# EasyEDA Pro project PCB.epro, board ESCSTRACk
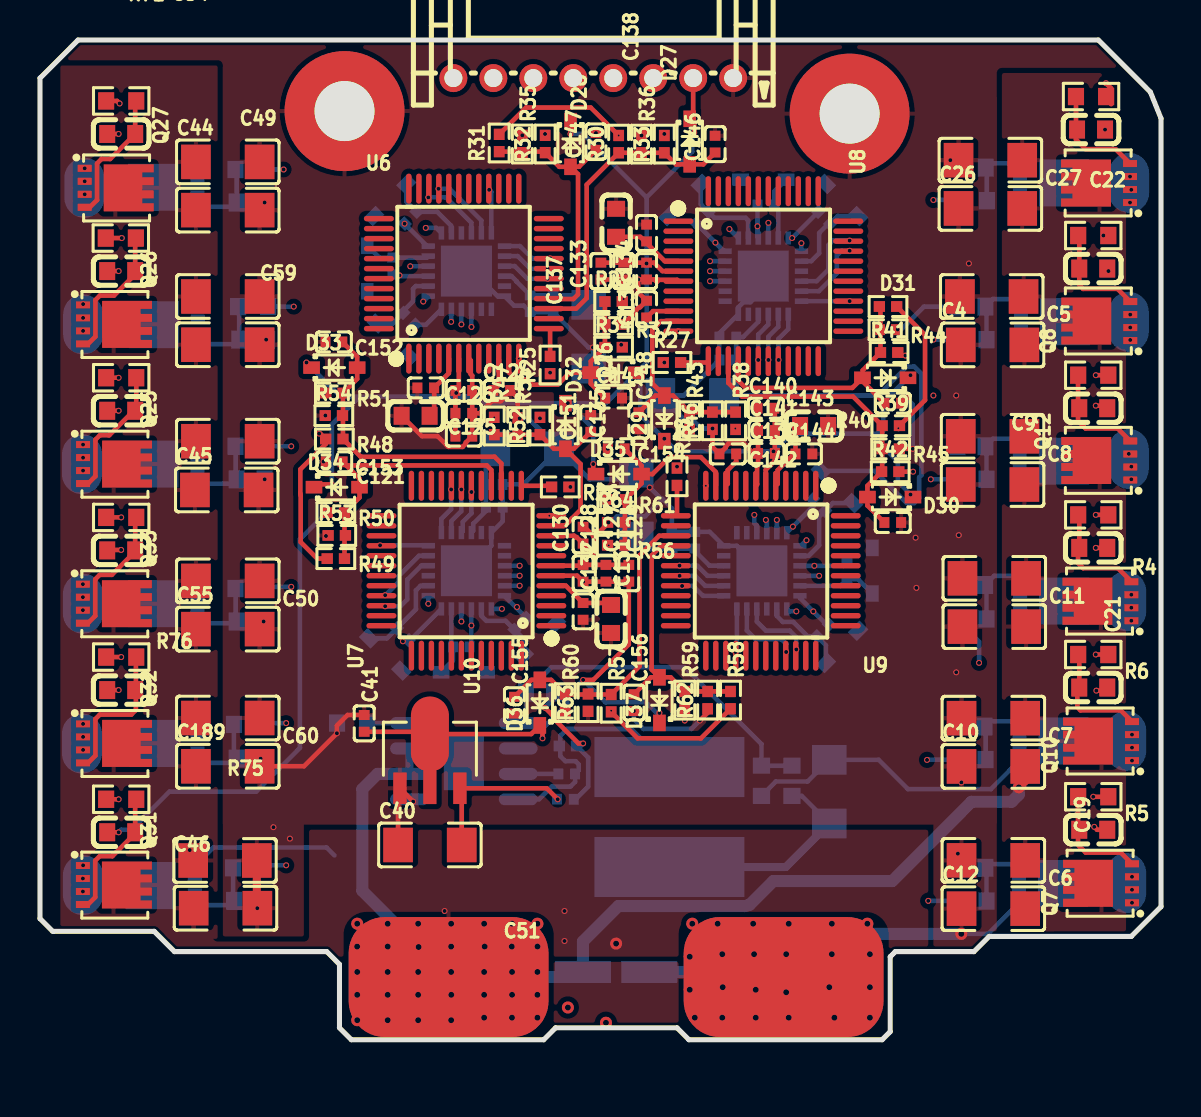
[diagram p0: board, top side]
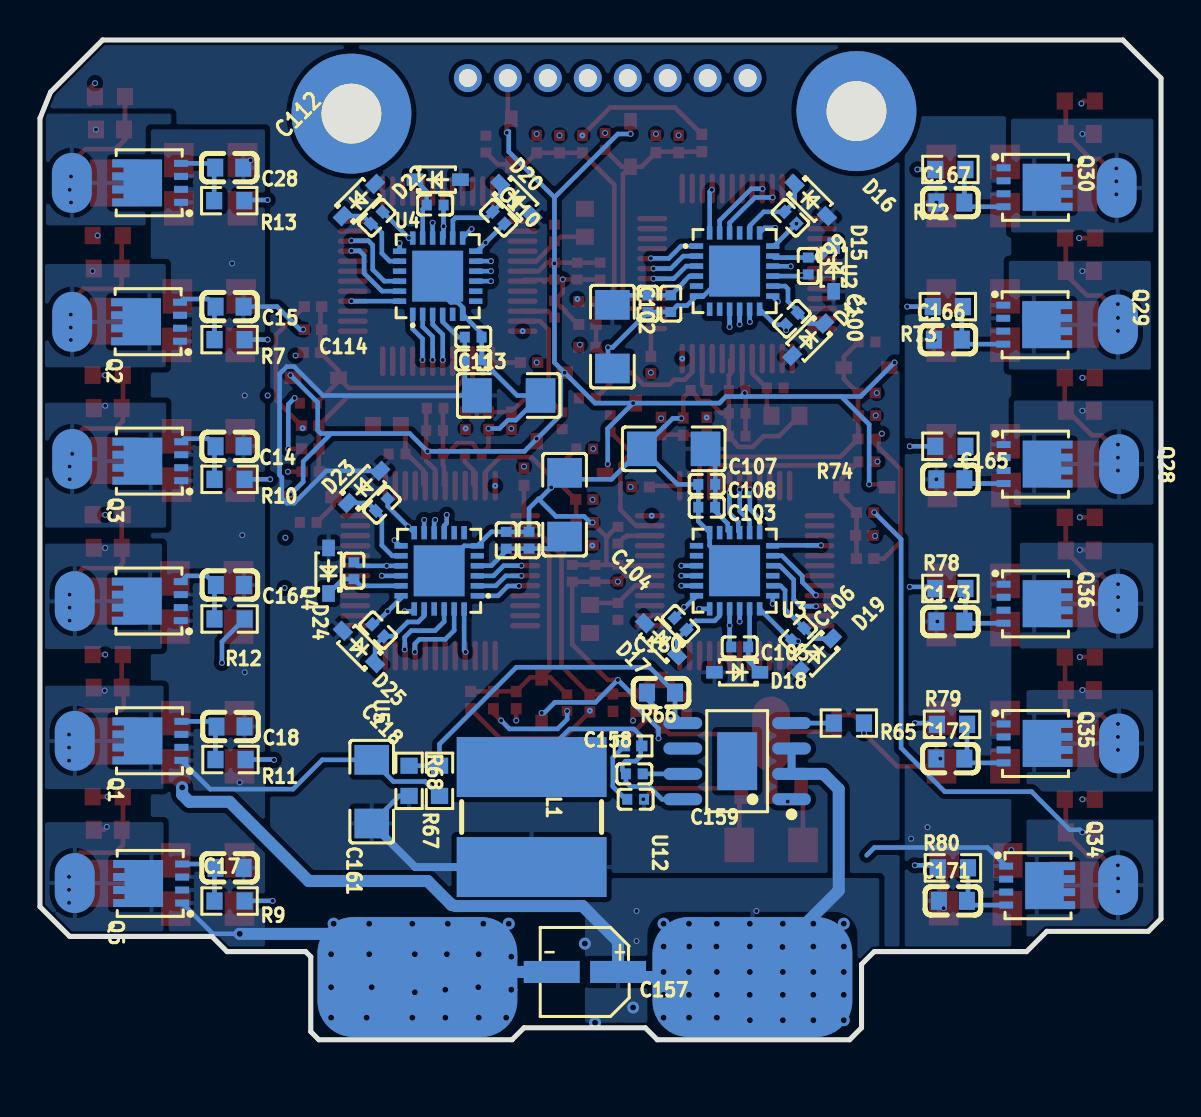
[diagram p1: board, bottom side, seen from below]

Outline 56.1 x 50 mm; copper layers: Top Layer, Inner1, Inner2, Inner3, Inner4, Bottom Layer. Coordinates in mm from the lower left corner of the outline.
Outline path: 0,48.09 1.91,50 52.96,50 55.56,47.39 56.1,46.08 56.1,6.66 54.61,5.17 47.5,5.17 46.74,4.41 42.8,4.41 42.54,4.15 42.54,0.41 42.14,0 32.47,0 31.88,0.6 25.8,0.6 25.2,0 15.58,0 14.99,0.6 14.99,3.77 14.35,4.41 6.73,4.41 5.72,5.42 0.64,5.42 0,6.06 0,48.09
Stack: Top Layer 0.035mm Outer layer thickness 1oz / Dielectric1 0.0994mm 3313 RC57% 4.2mil / Inner1 0.0152mm Inner layer thickness / Dielectric2 0.55mm 0.55mm H/H No copper / Inner2 0.0152mm Inner layer thickness / Dielectric3 0.1088mm 2116 RC54% 4.9mil / Inner3 0.0152mm Inner layer thickness / Dielectric4 0.55mm 0.55mm H/H No copper / Inner4 0.0152mm Inner layer thickness / Dielectric5 0.0994mm 3313 RC57% 4.2mil / Bottom Layer 0.035mm Outer layer thickness 1oz

## Design rules (mm)
spacing copperThickness1oz: track to track 0.102, other pairs 0.152 to 0.3
spacing copperThickness2oz (default): track to track 0.203, other pairs 0.152 to 0.3
spacing Plane_innerPlane: track to track 0.203, other pairs 0.152 to 0.3
spacing Copper_copperRegion: track to track 0.203, other pairs 0.152 to 0.3
track width copperThickness1oz: min 0.127, default 0.254, max 2.54
track width copperThickness2oz (default): min 0.203, default 0.254, max 2.54
differential pair differentialPair (default): width min 0.127, default 0.254, max 2.54; gap min 0.152, default 0.152
net VCC uses copperRegion_copperThickness2oz
net +10V uses copperRegion_copperThickness2oz
net GND uses copperRegion_copperThickness2oz
net +3.3V uses copperRegion_copperThickness2oz
net MOTORC_1 uses copperRegion_copperThickness2oz
net MOTORB_1 uses copperRegion_copperThickness2oz
net MOTORA_1 uses copperRegion_copperThickness2oz
net MOTORC_3 uses copperRegion_copperThickness2oz
net MOTORB_3 uses copperRegion_copperThickness2oz
net MOTORA_3 uses copperRegion_copperThickness2oz
net MOTORC_2 uses copperRegion_copperThickness2oz
net MOTORB_2 uses copperRegion_copperThickness2oz
net MOTORA_2 uses copperRegion_copperThickness2oz
net MOTORC_4 uses copperRegion_copperThickness2oz
net MOTORB_4 uses copperRegion_copperThickness2oz
pour e1518 uses Copper_copperRegion, copperRegion_Copper_copperRegion
pour e1630 uses Copper_copperRegion, copperRegion_Copper_copperRegion
pour e1638 uses Copper_copperRegion, copperRegion_Copper_copperRegion
pour e1646 uses Copper_copperRegion, copperRegion_Copper_copperRegion
pour e1655 uses Copper_copperRegion, copperRegion_Copper_copperRegion
pour e1664 uses Copper_copperRegion, copperRegion_Copper_copperRegion
pour e1683 uses Copper_copperRegion, copperRegion_Copper_copperRegion
pour e1735 uses Copper_copperRegion, copperRegion_Copper_copperRegion
pour e2060 uses Copper_copperRegion, copperRegion_Copper_copperRegion
pour e2069 uses Copper_copperRegion, copperRegion_Copper_copperRegion
pour e2078 uses Copper_copperRegion, copperRegion_Copper_copperRegion
pour e2087 uses Copper_copperRegion, copperRegion_Copper_copperRegion
pour e2096 uses Copper_copperRegion, copperRegion_Copper_copperRegion
pour e2105 uses Copper_copperRegion, copperRegion_Copper_copperRegion
pour e2114 uses Copper_copperRegion, copperRegion_Copper_copperRegion
pour e2161 uses Copper_copperRegion, copperRegion_Copper_copperRegion
pour e2200 uses Copper_copperRegion, copperRegion_Copper_copperRegion
pour e2254 uses Copper_copperRegion, copperRegion_Copper_copperRegion
pour e2417 uses Copper_copperRegion, copperRegion_Copper_copperRegion
pour e2712 uses Copper_copperRegion, copperRegion_Copper_copperRegion
pour e2740 uses Copper_copperRegion, copperRegion_Copper_copperRegion
pour e2744 uses Copper_copperRegion, copperRegion_Copper_copperRegion
pour e2758 uses Copper_copperRegion, copperRegion_Copper_copperRegion
pour e2765 uses Copper_copperRegion, copperRegion_Copper_copperRegion
pour e3007 uses Copper_copperRegion, copperRegion_Copper_copperRegion
pour e3047 uses Copper_copperRegion, copperRegion_Copper_copperRegion

## Placement (name value [footprint] x y rotation side)
C2  10uF  [C1206]  47.75 20.66 0 top
C4  10uF  [C1206]  47.67 34.75 0 top
C5  10uF  [C1206]  47.62 37.17 180 top
C6  10uF  [C1206]  47.71 8.97 180 top
C7  10uF  [C1206]  47.71 16.08 180 top
C8  10uF  [C1206]  47.67 30.18 180 top
C9  10uF  [C1206]  47.67 27.77 180 top
C10  10uF  [C1206]  47.71 13.67 0 top
C11  10uF  [C1206]  47.75 23.08 180 top
C12  10uF  [C1206]  47.71 6.56 0 top
C14  22nF  [C0603]  46.61 29.68 0 bottom
C15  22nF  [C0603]  46.61 36.66 0 bottom
C16  22nF  [C0603]  46.59 22.75 0 bottom
C17  22nF  [C0603]  46.61 8.6 0 bottom
C18  22nF  [C0603]  46.56 15.66 0 bottom
C19  22nF  [C0603]  52.71 10.5 0 top
C20  22nF  [C0603]  52.71 17.61 0 top
C21  22nF  [C0603]  52.71 24.6 0 top
C22  22nF  [C0603]  52.71 31.58 0 top
C23  22nF  [C0603]  52.71 38.57 0 top
C25  22nF  [C0603]  52.59 45.52 0 top
C26  10uF  [C1206]  47.56 41.58 0 top
C27  10uF  [C1206]  47.56 43.99 180 top
C28  22nF  [C0603]  46.63 43.62 0 bottom
C40  10uF  [C1206]  19.51 9.74 0 top
C41  22uF  [C0402]  16.22 15.82 270 top
C44  10uF  [C1206]  9.4 43.9 0 top
C45  10uF  [C1206]  9.35 27.5 0 top
C46  10uF  [C1206]  9.26 8.97 0 top
C49  10uF  [C1206]  9.4 41.49 180 top
C50  10uF  [C1206]  9.4 22.95 180 top
C51  10uF  [C1206]  9.28 6.58 180 top
C54  10uF  [C1206]  9.4 37.17 0 top
C55  10uF  [C1206]  9.4 20.54 0 top
C59  10uF  [C1206]  9.4 34.76 180 top
C60  10uF  [C1206]  9.4 16.09 180 top
C97  10nF  [C0402]  25.68 36.81 270 bottom
C98  1uF  [C0402]  24.53 36.81 270 bottom
C99  1uF  [C0402]  18.47 36.06 315 bottom
C100  1uF  [C0402]  17.65 38.7 270 bottom
C101  1uF  [C0402]  18.54 41.11 225 bottom
C102  10uF  [C1206]  27.45 35.16 270 bottom
C103  1uF  [C0402]  22.73 26.63 0 bottom
C104  1uF  [C0402]  24.04 20.8 45 bottom
C105  1uF  [C0402]  21.08 19.65 0 bottom
C106  1uF  [C0402]  18.16 20.28 315 bottom
C107  10uF  [C1206]  24.38 29.55 0 bottom
C108  10nF  [C0402]  22.73 27.78 0 bottom
C109  1uF  [C0402]  34.42 35.14 180 bottom
C110  1uF  [C0402]  33.15 41.11 225 bottom
C111  1uF  [C0402]  36.32 41.75 180 bottom
C112  1uF  [C0402]  39.24 41.11 135 bottom
C113  10uF  [C1206]  32.64 32.22 180 bottom
C114  10nF  [C0402]  34.42 34 180 bottom
C115  1uF  [C0402]  31.62 24.98 90 bottom
C116  1uF  [C0402]  38.99 26.75 135 bottom
C117  1uF  [C0402]  40.39 23.46 90 bottom
C118  1uF  [C0402]  39.18 20.48 45 bottom
C119  10uF  [C1206]  29.84 26.76 90 bottom
C120  10nF  [C0402]  32.77 24.98 90 bottom
C121  1uF  [C0402]  21.21 30.19 180 top
C122  1uF  [C0402]  21.21 32.47 180 top
C123  1uF  [C0402]  21.21 31.33 180 top
C124  100nF  [C0402]  23.11 32.47 0 top
C125  1uF  [C0603]  18.8 31.2 180 top
C126  10nF  [C0402]  19.3 32.6 180 top
C127  1uF  [C0402]  28.32 23.33 270 top
C128  1uF  [C0402]  27.18 23.33 270 top
C129  1uF  [C0402]  29.46 23.33 270 top
C130  100nF  [C0402]  27.18 25.23 90 top
C131  1uF  [C0603]  28.57 21.04 270 top
C132  10nF  [C0402]  27.18 21.42 270 top
C133  1uF  [C0402]  28.07 38.44 90 top
C134  1uF  [C0402]  30.35 38.44 90 top
C135  1uF  [C0402]  29.21 38.44 90 top
C136  100nF  [C0402]  30.35 36.54 90 top
C137  1uF  [C0603]  28.83 40.86 90 top
C138  10nF  [C0402]  30.35 40.35 90 top
C139  1uF  [C0402]  36.35 29.33 0 top
C140  1uF  [C0402]  36.32 31.58 0 top
C141  1uF  [C0402]  36.35 30.47 0 top
C142  100nF  [C0402]  34.42 29.3 180 top
C143  1uF  [C0603]  38.73 30.7 0 top
C144  10nF  [C0402]  38.23 29.3 0 top
C145  10nF  [C0402]  28.7 32.09 0 top
C146  10nF  [C0402]  33.78 44.79 90 top
C147  10nF  [C0402]  27.82 44.93 90 top
C148  10nF  [C0402]  29.97 30.96 270 top
C149  10nF  [C0402]  42.67 25.87 0 top
C150  10nF  [C0402]  42.68 31.84 0 top
C151  10nF  [C0402]  27.56 30.82 90 top
C152  10nF  [C0402]  14.71 34.9 180 top
C153  10nF  [C0402]  14.72 28.91 180 top
C154  10nF  [C0402]  28.84 29.56 180 top
C155  10nF  [C0402]  23.74 16.73 270 top
C156  10nF  [C0402]  29.72 16.86 270 top
C157  2.2uF  [CAP-SMD_BD4.0-L4.3-W4.3-FD]  28.83 3.39 0 bottom
C158  2.2nF  [C0402]  26.36 13.3 180 bottom
C159  3.3nF  [C0402]  26.29 12.03 0 bottom
C160  56pF  [C0603]  25.02 17.36 180 bottom
C161  47uF  [C1206]  39.5 12.41 90 bottom
C162  22nF  [C0603]  4.06 31.46 180 top
C163  22nF  [C0603]  4.06 38.44 180 top
C164  22nF  [C0603]  4.06 45.3 180 top
C165  22nF  [C0603]  10.54 28.03 180 bottom
C166  22nF  [C0603]  10.67 35.01 180 bottom
C167  22nF  [C0603]  10.54 41.87 180 bottom
C168  22nF  [C0603]  4.06 10.38 180 top
C169  22nF  [C0603]  4.06 17.49 180 top
C170  22nF  [C0603]  4.06 24.47 180 top
C171  22nF  [C0603]  10.41 6.95 180 bottom
C172  22nF  [C0603]  10.54 14.06 180 bottom
C173  22nF  [C0603]  10.54 20.92 180 bottom
C188  10uF  [C1206]  9.4 29.93 0 top
C189  10uF  [C1206]  9.4 13.68 0 top
D14  BAT54WS  [SOD-323_L1.7-W1.3-LS2.6-RD-1]  17.65 35.01 315 bottom
D15  BAT54WS  [SOD-323_L1.7-W1.3-LS2.6-RD-1]  16.38 38.57 270 bottom
D16  BAT54WS  [SOD-323_L1.7-W1.3-LS2.6-RD-1]  17.53 42 225 bottom
D17  BAT54WS  [SOD-323_L1.7-W1.3-LS2.6-RD-1]  25.02 20.03 45 bottom
D18  BAT54WS  [SOD-323_L1.7-W1.3-LS2.6-RD-1]  21.21 18.38 0 bottom
D19  BAT54WS  [SOD-323_L1.7-W1.3-LS2.6-RD-1]  17.27 19.27 315 bottom
D20  BAT54WS  [SOD-323_L1.7-W1.3-LS2.6-RD-1]  32.26 42 225 bottom
D21  BAT54WS  [SOD-323_L1.7-W1.3-LS2.6-RD-1]  36.19 43.02 180 bottom
D22  BAT54WS  [SOD-323_L1.7-W1.3-LS2.6-RD-1]  40.13 42 135 bottom
D23  BAT54WS  [SOD-323_L1.7-W1.3-LS2.6-RD-1]  39.88 27.65 135 bottom
D24  BAT54WS  [SOD-323_L1.7-W1.3-LS2.6-RD-1]  41.66 23.46 90 bottom
D25  BAT54WS  [SOD-323_L1.7-W1.3-LS2.6-RD-1]  40.13 19.65 45 bottom
D26  BAT54WS  [SOD-323_L1.7-W1.3-LS2.6-RD-1]  28.7 33.36 180 top
D27  BAT54WS  [SOD-323_L1.7-W1.3-LS2.6-RD-1]  32.51 44.92 270 top
D28  BAT54WS  [SOD-323_L1.7-W1.3-LS2.6-RD-1]  26.55 44.8 270 top
D29  BAT54WS  [SOD-323_L1.7-W1.3-LS2.6-RD-1]  31.24 31.08 90 top
D30  BAT54WS  [SOD-323_L1.7-W1.3-LS2.6-RD-1]  42.54 27.14 180 top
D31  BAT54WS  [SOD-323_L1.7-W1.3-LS2.6-RD-1]  42.29 33.11 180 top
D32  BAT54WS  [SOD-323_L1.7-W1.3-LS2.6-RD-1]  26.29 30.7 270 top
D33  BAT54WS  [SOD-323_L1.7-W1.3-LS2.6-RD-1]  14.73 33.61 0 top
D34  BAT54WS  [SOD-323_L1.7-W1.3-LS2.6-RD-1]  14.85 27.64 0 top
D35  BAT54WS  [SOD-323_L1.7-W1.3-LS2.6-RD-1]  28.96 28.29 0 top
D36  BAT54WS  [SOD-323_L1.7-W1.3-LS2.6-RD-1]  25.01 16.86 90 top
D37  BAT54WS  [SOD-323_L1.7-W1.3-LS2.6-RD-1]  31 16.99 90 top
L1  68uH  [IND-SMD_L7.8-W7.0_SUMIDA_CD73]  31.5 11.14 270 bottom
NOREF  -  [Pad_e1468]  54.48 35.9 0 top
NOREF#2  -  [Pad_e1504]  54.36 14.95 0 top
NOREF#3  -  [Pad_e3137]  40.51 46.32 90 top
NOREF#4  -  [Pad_e1469]  54.5 42.85 0 top
NOREF#5  -  [Pad_e1503]  54.36 21.93 0 top
NOREF#6  -  [Pad_e3031]  37.21 3.14 90 top
NOREF#7  -  [Pad_e1962]  2.22 42.61 180 top
NOREF#8  -  [Pad_e1963]  2.16 35.78 180 top
NOREF#9  -  [Pad_e1966]  2.1 14.82 180 top
NOREF#10  -  [Pad_e3123]  15.24 46.44 90 top
NOREF#11  -  [Pad_e1502]  54.48 29.05 0 top
NOREF#12  -  [Pad_e1965]  2.15 21.81 180 top
NOREF#13  -  [Pad_e1964]  2.1 28.79 180 top
NOREF#14  -  [Pad_e1505]  54.36 7.84 0 top
NOREF#15  -  [Pad_e1967]  2.15 7.73 180 top
NOREF#16  -  [Pad_e3030]  20.45 3.14 90 top
Q1  BSZ040N06LS5  [DFN-8_L3.3-W3.3-P0.65-BL-2]  49.78 14.95 90 bottom
Q2  BSZ040N06LS5  [DFN-8_L3.3-W3.3-P0.65-BL-2]  49.85 35.91 90 bottom
Q3  BSZ040N06LS5  [DFN-8_L3.3-W3.3-P0.65-BL-2]  49.79 28.94 90 bottom
Q4  BSZ040N06LS5  [DFN-8_L3.3-W3.3-P0.65-BL-2]  49.81 21.94 90 bottom
Q5  BSZ040N06LS5  [DFN-8_L3.3-W3.3-P0.65-BL-2]  49.75 7.81 90 bottom
Q7  BSZ040N06LS5  [DFN-8_L3.3-W3.3-P0.65-BL-2]  53.88 7.82 90 top
Q8  BSZ040N06LS5  [DFN-8_L3.3-W3.3-P0.65-BL-2]  53.79 35.94 90 top
Q10  BSZ040N06LS5  [DFN-8_L3.3-W3.3-P0.65-BL-2]  53.88 14.94 90 top
Q11  BSZ040N06LS5  [DFN-8_L3.3-W3.3-P0.65-BL-2]  53.85 21.93 90 top
Q12  BSZ040N06LS5  [DFN-8_L3.3-W3.3-P0.65-BL-2]  53.79 28.97 90 top
Q13  BSZ040N06LS5  [DFN-8_L3.3-W3.3-P0.65-BL-2]  49.8 42.85 90 bottom
Q14  BSZ040N06LS5  [DFN-8_L3.3-W3.3-P0.65-BL-2]  53.78 42.85 90 top
Q25  BSZ040N06LS5  [DFN-8_L3.3-W3.3-P0.65-BL-2]  2.92 28.79 270 top
Q26  BSZ040N06LS5  [DFN-8_L3.3-W3.3-P0.65-BL-2]  2.92 35.78 270 top
Q27  BSZ040N06LS5  [DFN-8_L3.3-W3.3-P0.65-BL-2]  3 42.61 270 top
Q28  BSZ040N06LS5  [DFN-8_L3.3-W3.3-P0.65-BL-2]  7.11 28.79 270 bottom
Q29  BSZ040N06LS5  [DFN-8_L3.3-W3.3-P0.65-BL-2]  7.13 35.76 270 bottom
Q30  BSZ040N06LS5  [DFN-8_L3.3-W3.3-P0.65-BL-2]  7.11 42.63 270 bottom
Q31  BSZ040N06LS5  [DFN-8_L3.3-W3.3-P0.65-BL-2]  2.91 7.74 270 top
Q32  BSZ040N06LS5  [DFN-8_L3.3-W3.3-P0.65-BL-2]  2.92 14.82 270 top
Q33  BSZ040N06LS5  [DFN-8_L3.3-W3.3-P0.65-BL-2]  2.91 21.81 270 top
Q34  BSZ040N06LS5  [DFN-8_L3.3-W3.3-P0.65-BL-2]  6.98 7.71 270 bottom
Q35  BSZ040N06LS5  [DFN-8_L3.3-W3.3-P0.65-BL-2]  7.11 14.82 270 bottom
Q36  BSZ040N06LS5  [DFN-8_L3.3-W3.3-P0.65-BL-2]  7.11 21.81 270 bottom
R1  10Ω  [R0603]  52.71 26.25 180 top
R3  10Ω  [R0603]  52.71 40.22 180 top
R4  10Ω  [R0603]  52.71 33.24 180 top
R5  10Ω  [R0603]  52.71 12.15 180 top
R6  10Ω  [R0603]  52.71 19.27 180 top
R7  10Ω  [R0603]  46.61 35.01 0 bottom
R9  10Ω  [R0603]  46.61 6.94 0 bottom
R10  10Ω  [R0603]  46.61 28.03 0 bottom
R11  10Ω  [R0603]  46.56 14.01 0 bottom
R12  10Ω  [R0603]  46.61 21.04 0 bottom
R13  10Ω  [R0603]  46.63 41.97 0 bottom
R14  10Ω  [R0603]  52.59 47.17 180 top
R25  1kΩ  [R0402]  25.53 33.74 90 top
R26  1kΩ  [R0402]  26.03 27.65 180 top
R27  1kΩ  [R0402]  31.62 33.87 0 top
R28  1kΩ  [R0402]  31.88 28.16 270 top
R29  10kΩ  [R0402]  28.7 36.92 0 top
R30  10kΩ  [R0402]  28.96 44.79 90 top
R31  10kΩ  [R0402]  22.98 44.85 90 top
R32  10kΩ  [R0402]  25.28 44.8 90 top
R33  10kΩ  [R0402]  31.24 44.79 90 top
R34  10kΩ  [R0402]  28.7 34.63 0 top
R35  1kΩ  [R0402]  24.14 44.8 270 top
R36  1kΩ  [R0402]  30.1 44.79 270 top
R37  1kΩ  [R0402]  28.7 35.78 180 top
R38  10kΩ  [R0402]  34.81 30.96 270 top
R39  10kΩ  [R0402]  42.58 30.71 0 top
R40  10kΩ  [R0402]  42.44 36.67 0 top
R41  10kΩ  [R0402]  42.49 34.37 0 top
R42  10kΩ  [R0402]  42.54 28.41 0 top
R43  10kΩ  [R0402]  32.5 30.96 270 top
R44  1kΩ  [R0402]  42.44 35.51 180 top
R45  1kΩ  [R0402]  42.57 29.55 180 top
R46  1kΩ  [R0402]  33.65 30.96 90 top
R47  10kΩ  [R0402]  22.73 30.7 90 top
R48  10kΩ  [R0402]  14.73 30.04 180 top
R49  10kΩ  [R0402]  14.81 24.06 180 top
R50  10kΩ  [R0402]  14.81 26.37 180 top
R51  10kΩ  [R0402]  14.73 32.34 180 top
R52  10kΩ  [R0402]  25.02 30.7 90 top
R53  1kΩ  [R0402]  14.85 25.22 0 top
R54  1kΩ  [R0402]  14.71 31.22 0 top
R55  1kΩ  [R0402]  23.91 30.67 270 top
R56  10kΩ  [R0402]  28.84 24.73 180 top
R57  10kΩ  [R0402]  28.58 16.83 270 top
R58  10kΩ  [R0402]  34.55 16.99 270 top
R59  10kΩ  [R0402]  32.26 16.99 270 top
R60  10kΩ  [R0402]  26.28 16.86 270 top
R61  10kΩ  [R0402]  28.86 27.02 180 top
R62  1kΩ  [R0402]  33.41 16.99 90 top
R63  1kΩ  [R0402]  27.43 16.86 90 top
R64  1kΩ  [R0402]  28.84 25.88 0 top
R65  100kΩ  [R0603]  15.62 15.84 0 bottom
R66  453kΩ  [R0402]  26.42 14.69 0 bottom
R67  10.2kΩ  [R0603]  36.1 12.95 90 bottom
R68  75kΩ  [R0603]  37.63 12.95 270 bottom
R69  10Ω  [R0603]  4.06 33.11 0 top
R70  10Ω  [R0603]  4.05 40.09 0 top
R71  10Ω  [R0603]  4.06 46.95 0 top
R72  10Ω  [R0603]  10.54 43.52 180 bottom
R73  10Ω  [R0603]  10.67 36.66 180 bottom
R74  10Ω  [R0603]  10.54 29.68 180 bottom
R75  10Ω  [R0603]  4.06 12.03 0 top
R76  10Ω  [R0603]  4.06 19.14 0 top
R77  10Ω  [R0603]  4.06 26.12 0 top
R78  10Ω  [R0603]  10.54 22.57 180 bottom
R79  10Ω  [R0603]  10.46 15.77 180 bottom
R80  10Ω  [R0603]  10.41 8.6 180 bottom
U1  S8B-PH-K-S(LF)(SN)  [CONN-TH_S8B-PH-K-S-LF-SN]  27.69 48.09 0 top
U2  FD6288Q  [QFN-24_L4.0-W4.0-P0.50-BL-EP2.6]  21.34 38.44 270 bottom
U3  FD6288Q  [QFN-24_L4.0-W4.0-P0.50-BL-EP2.6]  21.34 23.46 0 bottom
U4  FD6288Q  [QFN-24_L4.0-W4.0-P0.50-BL-EP2.6]  36.19 38.19 180 bottom
U5  FD6288Q  [QFN-24_L4.0-W4.0-P0.50-BL-EP2.6]  36.12 23.45 90 bottom
U6  STM32G071CBT6  [LQFP-48_L7.0-W7.0-P0.50-LS9.0-BL]  21.21 38.32 0 top
U7  STM32G071CBT6  [LQFP-48_L7.0-W7.0-P0.50-LS9.0-BL]  21.34 23.46 90 top
U8  STM32G071CBT6  [LQFP-48_L7.0-W7.0-P0.50-LS9.0-BL]  36.19 38.19 270 top
U9  STM32G071CBT6  [LQFP-48_L7.0-W7.0-P0.50-LS9.0-BL]  36.07 23.46 180 top
U10  CJA1117B-3.3  [SOT-89-3_L4.5-W2.5-P1.50-LS4.2-BR]  19.51 13.93 270 top
U12  LM5164QDDATQ1  [SOIC-8_L4.9-W3.9-P1.27-LS6.0-BL-EP2.9]  21.21 13.93 90 bottom

## Footprints (pads in the part's own frame, mm; a bottom-side part is the same pattern mirrored in y, then rotated)
C0402
  rect 0.5x0.54 smd: 1(-0.42,0) 2(0.42,0)
C0603
  rect 0.8x0.9 smd: 1(-0.7,0) 2(0.7,0)
C1206
  rect 1.485x1.728 smd: 1(-1.593,0) 2(1.593,0)
CAP-SMD_BD4.0-L4.3-W4.3-FD
  rect 2.8x1.1 smd: 1(-1.661,0) 2(1.661,0)
CONN-TH_S8B-PH-K-S-LF-SN
  round 1.4 hole 0.9: 1(7,0) 2(5,0) 3(3,0) 4(1,0) 5(-1,0) 6(-3,0) 7(-5,0) 8(-7,0)
DFN-8_L3.3-W3.3-P0.65-BL-2
  rect 0.35x0.7 smd: 1(-0.975,-0.765) 2(-0.325,-0.765) 3(0.325,-0.765) 4(0.975,-0.765)
  custom 2.352x2.498 smd: 5(0,0.765)
IND-SMD_L7.8-W7.0_SUMIDA_CD73
  rect 3x7.5 smd: 1(-2.5,0) 2(2.5,0)
LQFP-48_L7.0-W7.0-P0.50-LS9.0-BL
  oval 0.27x1.5 smd: 1(-2.75,-4.25) 2(-2.25,-4.25) 3(-1.75,-4.25) 4(-1.25,-4.25) 5(-0.75,-4.25) 6(-0.25,-4.25) 7(0.25,-4.25) 8(0.75,-4.25) 9(1.25,-4.25) 10(1.75,-4.25) 11(2.25,-4.25) 12(2.75,-4.25) 25(2.75,4.25) 26(2.25,4.25) 27(1.75,4.25) 28(1.25,4.25) 29(0.75,4.25) 30(0.25,4.25) 31(-0.25,4.25) 32(-0.75,4.25) 33(-1.25,4.25) 34(-1.75,4.25) 35(-2.25,4.25) 36(-2.75,4.25)
  oval 1.5x0.27 smd: 13(4.25,-2.75) 14(4.25,-2.25) 15(4.25,-1.75) 16(4.25,-1.25) 17(4.25,-0.75) 18(4.25,-0.25) 19(4.25,0.25) 20(4.25,0.75) 21(4.25,1.25) 22(4.25,1.75) 23(4.25,2.25) 24(4.25,2.75) 37(-4.25,2.75) 38(-4.25,2.25) 39(-4.25,1.75) 40(-4.25,1.25) 41(-4.25,0.75) 42(-4.25,0.25) 43(-4.25,-0.25) 44(-4.25,-0.75) 45(-4.25,-1.25) 46(-4.25,-1.75) 47(-4.25,-2.25) 48(-4.25,-2.75)
Pad_e1468
  oval 2x3 smd far side: 1(0,0)
Pad_e1469
  oval 2x3 smd far side: 1(0,0)
Pad_e1502
  oval 2x3 smd far side: 1(0,0)
Pad_e1503
  oval 2x3 smd far side: 1(0,0)
Pad_e1504
  oval 2x3 smd far side: 1(0,0)
Pad_e1505
  oval 2x3 smd far side: 1(0,0)
Pad_e1962
  oval 2x3 smd far side: 1(0,0)
Pad_e1963
  oval 2x3 smd far side: 1(0,0)
Pad_e1964
  oval 2x3 smd far side: 1(0,0)
Pad_e1965
  oval 2x3 smd far side: 1(0,0)
Pad_e1966
  oval 2x3 smd far side: 1(0,0)
Pad_e1967
  oval 2x3 smd far side: 1(0,0)
Pad_e3030
  rrect 6x10 hole 0.001: 1(0,0)
Pad_e3031
  rrect 6x10 hole 0.001: 1(0,0)
Pad_e3123
  round 6 hole 3: 1(0,0)
Pad_e3137
  round 6 hole 3: 1(0,0)
QFN-24_L4.0-W4.0-P0.50-BL-EP2.6
  rect 0.28x0.665 smd: 1(-1.25,-1.907) 2(-0.75,-1.907) 3(-0.25,-1.907) 4(0.25,-1.907) 5(0.75,-1.907) 6(1.25,-1.907) 13(1.25,1.907) 14(0.75,1.907) 15(0.25,1.907) 16(-0.25,1.907) 17(-0.75,1.907) 18(-1.25,1.907)
  rect 0.665x0.28 smd: 7(1.907,-1.25) 8(1.907,-0.75) 9(1.907,-0.25) 10(1.907,0.25) 11(1.907,0.75) 12(1.907,1.25) 19(-1.907,1.25) 20(-1.907,0.75) 21(-1.907,0.25) 22(-1.907,-0.25) 23(-1.907,-0.75) 24(-1.907,-1.25)
  rect 2.55x2.55 smd: 25(0,0)
R0402
  rect 0.566x0.54 smd: 1(-0.433,0) 2(0.433,0)
R0603
  rect 0.806x0.864 smd: 1(-0.753,0) 2(0.753,0)
SOD-323_L1.7-W1.3-LS2.6-RD-1
  rect 0.83x0.63 smd: 1(-1.14,0) 2(1.14,0)
SOIC-8_L4.9-W3.9-P1.27-LS6.0-BL-EP2.9
  oval 0.602x1.941 smd: 1(-1.905,-2.72) 2(-0.635,-2.72) 3(0.635,-2.72) 4(1.905,-2.72) 5(1.905,2.72) 6(0.635,2.72) 7(-0.635,2.72) 8(-1.905,2.72)
  rect 2.9x2 smd: 9(0,0)
SOT-89-3_L4.5-W2.5-P1.50-LS4.2-BR
  rect 1.575x0.672 smd: 1(1.356,-1.5) 3(1.356,1.5)
  custom 5.377x1.9 smd: 2(-1.356,0)

## Nets
+3.3V: C41.2 C121.2 C122.2 C123.2 C127.2 C128.2 C129.2 C133.2 C134.2 C135.2 C139.2 C140.2 C141.2 D26.1 D27.1 D28.1 D29.1 D30.1 D31.1 D32.1 D33.1 D34.1 D35.1 D36.1 D37.1 U1.2 U6.6 U7.6 U8.6 U9.6 U10.2
+10V: C40.2 C97.1 C98.1 C102.1 C103.1 C107.1 C108.1 C109.1 C113.1 C114.1 C115.1 C119.1 C120.1 C159.1 C161.1 D14.2 D15.2 D16.2 D17.2 D18.2 D19.2 D20.2 D21.2 D22.2 D23.2 D24.2 D25.2 L1.2 R68.2 U2.4 U3.4 U4.4 U5.4 U10.3
GND: C2.1 C4.1 C5.2 C6.2 C7.2 C8.2 C9.2 C10.1 C11.2 C12.1 C14.1 C15.1 C16.1 C17.1 C18.1 C26.1 C27.2 C28.1 C40.1 C41.1 C44.2 C45.2 C46.2 C49.1 C50.1 C51.1 C54.2 C55.2 C59.1 C60.1 C97.2 C98.2 C102.2 C103.2 C107.2 C108.2 C109.2 C113.2 C114.2 C115.2 C119.2 C120.2 C121.1 C122.1 C123.1 C124.2 C125.2 C126.2 C127.1 C128.1 C129.1 C130.2 C131.2 C132.2 C133.1 C134.1 C135.1 C136.2 C137.2 C138.2 C139.1 C140.1 C141.1 C142.2 C143.2 C144.2 C145.2 C146.2 C147.2 C148.2 C149.2 C150.2 C151.2 C152.2 C153.2 C154.2 C155.2 C156.2 C157.2 C161.2 C165.1 C166.1 C167.1 C171.1 C172.1 C173.1 C188.2 C189.2 NOREF#3.1 NOREF#6.1 NOREF#10.1 Q1.1 Q1.2 Q1.3 Q2.1 Q2.2 Q2.3 Q3.1 Q3.2 Q3.3 Q4.1 Q4.2 Q4.3 Q5.1 Q5.2 Q5.3 Q13.1 Q13.2 Q13.3 Q28.1 Q28.2 Q28.3 Q29.1 Q29.2 Q29.3 Q30.1 Q30.2 Q30.3 Q34.1 Q34.2 Q34.3 Q35.1 Q35.2 Q35.3 Q36.1 Q36.2 Q36.3 R35.1 R36.1 R37.1 R44.1 R45.1 R46.1 R53.1 R54.1 R55.1 R62.1 R63.1 R64.1 R65.1 R67.1 U1.1 U2.6 U2.25 U3.6 U3.25 U4.6 U4.25 U5.6 U5.25 U6.7 U7.7 U8.7 U9.7 U10.1 U12.1
VCC: C2.2 C4.2 C5.1 C6.1 C7.1 C8.1 C9.1 C10.2 C11.1 C12.2 C26.2 C27.1 C44.1 C45.1 C46.1 C49.2 C50.2 C51.2 C54.1 C55.1 C59.2 C60.2 C157.1 C188.1 C189.1 NOREF#16.1 Q7.5 Q8.5 Q10.5 Q11.5 Q12.5 Q14.5 Q25.5 Q26.5 Q27.5 Q31.5 Q32.5 Q33.5 U12.2 U12.3
AHIGH_1: U2.22 U6.34
AHIGH_2: U4.22 U8.34
AHIGH_3: U3.22 U7.34
AHIGH_4: U5.22 U9.34
ALOW_1: U2.1 U6.20
ALOW_2: U4.1 U8.20
ALOW_3: U3.1 U7.20
ALOW_4: U5.1 U9.20
BEMF_COMMON_1: R29.2 R30.2 R31.2 U6.12
BEMF_COMMON_2: R38.2 R39.2 R40.2 U8.12
BEMF_COMMON_3: R47.2 R48.2 R49.2 U7.12
BEMF_COMMON_4: R56.2 R57.2 R58.2 U9.12
BEMFA_1: C145.1 D26.2 R29.1 R34.1 R37.2 U6.11
BEMFA_2: C148.1 D29.2 R38.1 R43.1 R46.2 U8.11
BEMFA_3: C151.1 D32.2 R47.1 R52.1 R55.2 U7.11
BEMFA_4: C154.1 D35.2 R56.1 R61.1 R64.2 U9.11
BEMFB_1: C146.1 D27.2 R30.1 R33.1 R36.2 U6.15
BEMFB_2: C149.1 D30.2 R39.1 R42.1 R45.2 U8.15
BEMFB_3: C152.1 D33.2 R48.1 R51.1 R54.2 U7.15
BEMFB_4: C155.1 D36.2 R57.1 R60.1 R63.2 U9.15
BEMFC_1: C147.1 D28.2 R31.1 R32.1 R35.2 U6.16
BEMFC_2: C150.1 D31.2 R40.1 R41.1 R44.2 U8.16
BEMFC_3: C153.1 D34.2 R49.1 R50.1 R53.2 U7.16
BEMFC_4: C156.1 D37.2 R58.1 R59.1 R62.2 U9.16
BHIGH_1: U2.23 U6.33
BHIGH_2: U4.23 U8.33
BHIGH_3: U3.23 U7.33
BHIGH_4: U5.23 U9.33
BLOW_1: U2.2 U6.19
BLOW_2: U4.2 U8.19
BLOW_3: U3.2 U7.19
BLOW_4: U5.2 U9.19
CHIGH_1: U2.24 U6.28
CHIGH_2: U4.24 U8.28
CHIGH_3: U3.24 U7.28
CHIGH_4: U5.24 U9.28
CLOW_1: U2.3 U6.18
CLOW_2: U4.3 U8.18
CLOW_3: U3.3 U7.18
CLOW_4: U5.3 U9.18
GHA_1: R71.1 U2.19
GHA_2: R4.1 U4.19
GHA_3: R77.1 U3.19
GHA_4: R5.1 U5.19
GHB_1: R70.1 U2.16
GHB_2: R3.1 U4.16
GHB_3: R76.1 U3.16
GHB_4: R6.1 U5.16
GHC_1: R69.1 U2.13
GHC_2: R14.1 U4.13
GHC_3: R75.1 U3.13
GHC_4: R1.1 U5.13
GLA_1: R72.1 U2.11
GLA_2: R10.1 U4.11
GLA_3: R78.1 U3.11
GLA_4: R9.1 U5.11
GLB_1: R73.1 U2.10
GLB_2: R7.1 U4.10
GLB_3: R79.1 U3.10
GLB_4: R11.1 U5.10
GLC_1: R74.1 U2.9
GLC_2: R13.1 U4.9
GLC_3: R80.1 U3.9
GLC_4: R12.1 U5.9
MOTORA_1: C101.2 C164.2 NOREF#7.1 Q27.1 Q27.2 Q27.3 Q30.5 R34.2 U2.18
MOTORA_2: C22.2 C112.2 NOREF#11.1 Q3.5 Q12.1 Q12.2 Q12.3 R43.2 U4.18
MOTORA_3: C106.2 C170.2 NOREF#12.1 Q33.1 Q33.2 Q33.3 Q36.5 R52.2 U3.18
MOTORA_4: C19.2 C118.2 NOREF#14.1 Q5.5 Q7.1 Q7.2 Q7.3 R61.2 U5.18
MOTORB_1: C100.2 C163.2 NOREF#8.1 Q26.1 Q26.2 Q26.3 Q29.5 R33.2 U2.15
MOTORB_2: C23.2 C111.2 NOREF.1 Q2.5 Q8.1 Q8.2 Q8.3 R42.2 U4.15
MOTORB_3: C105.2 C169.2 NOREF#9.1 Q32.1 Q32.2 Q32.3 Q35.5 R51.2 U3.15
MOTORB_4: C20.2 C117.2 NOREF#2.1 Q1.5 Q10.1 Q10.2 Q10.3 R60.2 U5.15
MOTORC_1: C99.2 C162.2 NOREF#13.1 Q25.1 Q25.2 Q25.3 Q28.5 R32.2 U2.12
MOTORC_2: C25.2 C110.2 NOREF#4.1 Q13.5 Q14.1 Q14.2 Q14.3 R41.2 U4.12
MOTORC_3: C104.2 C168.2 NOREF#15.1 Q31.1 Q31.2 Q31.3 Q34.5 R50.2 U3.12
MOTORC_4: C21.2 C116.2 NOREF#5.1 Q4.5 Q11.1 Q11.2 Q11.3 R59.2 U5.12
S-INPUT_1: R25.1 U1.5
S-INPUT_2: R27.1 U1.6
S-INPUT_3: R26.1 U1.7
S-INPUT_4: R28.1 U1.8
SWDCLK_1: U6.36
SWDCLK_2: U8.36
SWDCLK_3: U7.36
SWDCLK_4: U9.36
SWDIO_1: U6.35
SWDIO_2: U8.35
SWDIO_3: U7.35
SWDIO_4: U9.35
$1N8406: C162.1 Q25.4 R69.2
$1N8410: C163.1 Q26.4 R70.2
$1N8414: C164.1 Q27.4 R71.2
$1N9597: C168.1 Q31.4 R75.2
$1N9600: C169.1 Q32.4 R76.2
$1N9603: C170.1 Q33.4 R77.2
$1N10287: C25.1 Q14.4 R14.2
$1N10290: C23.1 Q8.4 R3.2
$1N10293: C22.1 Q12.4 R4.2
$1N10977: C21.1 Q11.4 R1.2
$1N10980: C20.1 Q10.4 R6.2
$1N10983: C19.1 Q7.4 R5.2
$1N11003: C14.2 Q3.4 R10.2
$1N11004: C15.2 Q2.4 R7.2
$1N11005: C28.2 Q13.4 R13.2
$1N11006: C165.2 Q28.4 R74.2
$1N11007: C166.2 Q29.4 R73.2
$1N11008: C167.2 Q30.4 R72.2
$1N11009: C173.2 Q36.4 R78.2
$1N11010: C172.2 Q35.4 R79.2
$1N11011: C171.2 Q34.4 R80.2
$1N11012: C17.2 Q5.4 R9.2
$1N11013: C18.2 Q1.4 R11.2
$1N11014: C16.2 Q4.4 R12.2
$2N1449: C99.1 D14.1 U2.14
$2N1456: C100.1 D15.1 U2.17
$2N1466: C101.1 D16.1 U2.20
$2N2003: C104.1 D17.1 U3.14
$2N2012: C105.1 D18.1 U3.17
$2N2033: C106.1 D19.1 U3.20
$2N2566: C110.1 D20.1 U4.14
$2N2575: C111.1 D21.1 U4.17
$2N2596: C112.1 D22.1 U4.20
$2N3129: C116.1 D23.1 U5.14
$2N3138: C117.1 D24.1 U5.17
$2N3159: C118.1 D25.1 U5.20
$3N606: C124.1 U6.10
$3N612: R25.2 U6.13
$3N615: C125.1 C126.1 U6.5
$3N1168: C130.1 U7.10
$3N1174: R26.2 U7.13
$3N1177: C131.1 C132.1 U7.5
$3N1730: C136.1 U8.10
$3N1736: R27.2 U8.13
$3N1739: C137.1 C138.1 U8.5
$3N2292: C142.1 U9.10
$3N2298: R28.2 U9.13
$3N2301: C143.1 C144.1 U9.5
$4N5396: R65.2 U12.4
$4N5610: C158.2 U12.7
$4N5614: C158.1 L1.1 R66.1 U12.8
$4N5724: C159.2 C160.1 R66.2
$4N5787: C160.2 R67.2 R68.1 U12.5

Pads without a net: U1 3 4; U2 5 7 8 21; U3 5 7 8 21; U4 5 7 8 21; U5 5 7 8 21; U6 1 2 3 4 8 9 14 17 21 22 23 24 25 26 27 29 30 31 32 37 38 39 40 41 42 43 44 45 46 47 48; U7 1 2 3 4 8 9 14 17 21 22 23 24 25 26 27 29 30 31 32 37 38 39 40 41 42 43 44 45 46 47 48; U8 1 2 3 4 8 9 14 17 21 22 23 24 25 26 27 29 30 31 32 37 38 39 40 41 42 43 44 45 46 47 48; U9 1 2 3 4 8 9 14 17 21 22 23 24 25 26 27 29 30 31 32 37 38 39 40 41 42 43 44 45 46 47 48; U12 6 9

## Via types
v1: diameter 0.3, hole 0.2, Top Layer to Bottom Layer, 211 vias
v2: diameter 0.6, hole 0.3, Top Layer to Bottom Layer, 64 vias
v3: diameter 0.3, hole 0.1, Top Layer to Bottom Layer, 11 vias

## Routing (per net, layer and track width the routed paths; a pad name or vN(x,y) marks a point on that pad's centre or on a via; arc(x,y) is an arc through that point)
+3.3V: length 114.2
  Top Layer w0.23: D37.1 v1(31,16.34) ; D28.1 26.55,45.31 v1(26.54,45.3) ; v1(13.34,33.87) 13.59,33.61 ; U7.6 26.88,23.21 v1(27.18,22.91) C127.2 C129.2 29.46,19.77 27.69,18 v1(27.18,18) ; C121.2 C123.2 C122.2 20.96,32.64 U6.6 ; D34.1 13.85,27.78 v1(14.6,27.78) ; C140.2 36.77,31.55 C141.2 C139.2 36.77,28.96 36.32,28.5 U9.6 ; U8.6 31.94,38.44 31.15,38.44 30.72,38.86 C134.2 C135.2 C133.2 ; v1(32.74,45.36) 32.74,45.83 D27.1 32.69,46.23 U1.2 ; D35.1 27.69,28.42 v1(27.69,28.79) ; v1(25.15,15.08) 25.15,15.59 D36.1 24.58,15.29 U10.2 19.4,15.4 C41.2
  Bottom Layer w0.23: v1(14.6,27.78) 14.6,30.78 16,32.17 ; v1(43.56,27.27) 42.93,27.9 42.93,28.92 41.53,30.31 ; 21,32.17 21.76,32.17 22.1,31.84 v1(26.42,31.84) ; 21,32.17 16,32.17 ; 21,32.17 v1(20.83,32.35) ; v1(26.54,45.3) 27.18,45.3 30.35,42.13 ; v1(29.84,33.36) 30.04,33.17 30.04,31.25 31.22,30.06 ; v1(29.84,33.36) 28.32,31.84 v1(26.42,31.84) ; v1(29.84,33.36) 30.35,33.87 v1(30.35,38.82) 30.35,42.13 ; v1(26.42,31.84) 27.69,30.57 v1(27.69,28.79) ; v1(43.56,33.24) 42.2,31.87 42.2,30.48 42.04,30.31 41.53,30.31 ; 16,32.17 15.03,32.17 v1(13.34,33.87) ; 30.35,42.13 32.64,44.41 32.64,45.43 32.68,45.43 v1(32.74,45.36) ; 31.22,30.06 31.86,29.43 v1(36.7,29.43) 37.59,30.31 41.53,30.31 ; 31.22,30.06 v1(31.24,30.06) ; v1(25.15,15.08) 25.15,15.56 26.39,16.8 26.39,17.2 v1(27.18,18) 28.3,16.87 30.33,16.87 30.86,16.34 v1(31,16.34)
+10V: length 61.4
  Top Layer w0.23: v1(25.91,12.03) 25.36,12.58 U10.3 21.1,12.48 C40.2
  Bottom Layer w0.23: C161.1 38.12,12.2 R68.2 ; U5.4 34.2,23.71 33.5,23.71 32.77,24.45 C120.1 C115.1 30.45,24.56 C119.1 ; C102.1 26.97,37.23 C97.1 C98.1 23.84,37.92 23.84,37.94 23.59,38.19 U2.4 ; C107.1 22.31,29.07 C108.1 C103.1 22.31,26.44 21.68,25.81 21.68,25.46 U3.4 ; 39.07,28.45 41.76,28.45 43.38,26.83 43.74,26.83 43.99,27.09 43.99,28.13 44.1,28.24 44.1,33.3 43.74,33.67 43.38,33.67 41.93,32.22 C113.1 34.84,32.83 C114.1 C109.1 35.18,35.14 35.94,35.91 U4.4
  Bottom Layer w0.4: L1.2 37.32,8.64 C161.1
GND: length 151.5
  Top Layer w0.23: v1(29.94,38.03) 30.74,38.03 30.86,37.9 30.97,38.01 31.88,38.01 U8.7 ; v1(29.94,38.03) 29.21,38.03 C135.1 C133.1 ; v1(29.94,38.03) 29.94,37.38 C136.2 30.03,36.64 29.97,36.64 29.82,36.48 29.82,36.42 29.17,35.78 R37.1 ; 35.93,29.33 35.93,28.73 35.88,28.68 35.88,27.77 U9.7 ; 35.93,29.33 35.93,31.55 35.9,31.58 ; 35.93,29.33 35.71,29.33 35.2,29.84 34.48,29.84 34.32,29.68 34.32,29.62 C142.2 33.66,29.64 v1(33.66,30.57) ; R62.1 33.41,16.35 v1(33.02,15.96) ; R55.1 23.91,32.1 C124.2 23.21,32.15 23.21,32.09 23.05,31.94 22.61,31.94 22,31.33 C123.1 ; 27.75,23.75 C128.1 27.13,23.71 U7.7 ; 27.75,23.75 C127.1 C129.1 ; 27.75,23.75 27.75,25.08 27.72,25.12 ; C40.1 17.92,12.48 U10.1 v1(18.68,11.91) ; C189.2 13.21,13.68 v1(14.86,15.33) 14.86,15.71 15.39,16.24 C41.1 ; R64.1 28.4,25.81 27.72,25.12 ; v1(43.67,29.55) R45.1 ; 27.72,25.12 27.72,25.18 27.24,25.66 C130.2 ; C150.2 v1(43.35,32.09) ; C125.2 19.11,30.19 19.89,30.19 20.43,29.65 21.15,29.65 21.31,29.81 21.31,29.86 C121.1 C123.1 ; U6.7 21.56,33.97 21.56,33.28 21.63,33.21 C122.1 C123.1
  Top Layer w0.4: v1(10.88,6.58) 10.85,6.61 C46.2
  Bottom Layer w0.23: v1(43.35,32.09) 43.67,31.78 v1(43.67,29.55) ; Q1.1 47.58,12.53 43.43,12.53 41.97,14 C161.2 38.41,12.92 36.82,12.92 R67.1 ; C15.1 44.23,36.66 43.09,35.52 v1(42.93,35.52) ; C107.2 27.5,28.03 29.52,28.03 C119.2 29.84,28.29 v1(30.51,27.62) 31.09,27.05 31.15,27.05 ; C107.2 24.2,27.78 C108.2 C103.2 23.15,25.93 U3.6 22.59,24.71 U3.25 ; C107.2 24.87,30.66 24.85,30.66 24.43,31.08 v1(24,31.08) ; U2.25 21.99,38.44 22.35,38.08 22.35,37.73 22.91,37.17 23.22,37.17 U2.6 23.72,36.72 24.21,36.72 C98.2 C97.2 27.44,34.63 v1(27.67,34.63) 27.67,33.79 C102.2 ; 14.73,9.22 14.34,9.61 8.68,9.61 Q34.1 ; v1(33.02,15.96) 32.6,15.55 30.2,15.55 29.72,16.03 v1(29.72,16.44) ; v1(33.66,30.57) 33.1,30.57 32.68,30.99 32.28,30.99 C113.2 32.22,32.22 C114.2 C109.2 34,35.33 U4.6 34.93,36.3 34.93,36.61 35.19,36.88 35.54,36.88 36.19,37.53 U4.25 ; R65.1 14.86,15.83 v1(14.86,15.33) ; 31.15,27.05 31.62,26.57 C115.2 C120.2 33.51,25.4 U5.6 34.87,24.7 U5.25 ; 31.15,27.05 30.28,26.18 28.87,26.18 28.56,25.87 v1(28.45,25.87) ; v2(46.1,5.3) 47.44,5.3 Q5.1
  Bottom Layer w0.6: C157.2 36.96,3.39 37.02,3.33 38.99,5.3 v2(46.1,5.3)
  vias: v1(11.04,14.06) v1(11.19,20.92) v1(11.24,41.87) v1(11.24,28.03) v1(11.32,35.01) v1(11.68,10.63) v1(12.51,10.06) v1(14.19,28.92) v1(14.28,31.22) v1(14.31,25.19) v1(24.14,45.23) v1(27.82,45.35) v1(28.42,29.56) v1(30.1,45.23) v1(43.81,25.11) v1(43.85,22.6) v1(45.55,43.99) v1(45.85,32.22) v1(45.85,18.38) v1(45.97,25.23) v1(45.93,9.31) v1(46.11,12.87) v1(46.48,38.82) v2(32.51,4.15) v2(32.51,2.5) v2(32.64,5.8) v2(32.77,1.11) v2(33.91,5.8) v2(34.14,4.28) v2(34.16,2.63) v2(34.14,1.11) v2(35.69,5.8) v2(35.73,4.28) v2(35.81,2.5) v2(35.81,1.11) v2(37.34,4.28) v2(37.34,2.38) v2(37.47,5.8) v2(37.47,1.11) v2(39.5,2.63) v2(39.62,5.8) v2(39.62,4.28) v2(39.75,1.11) v2(41.4,5.8) v2(41.53,4.28) v2(41.53,2.63) v2(41.53,1.11)
VCC: length 49.9
  Top Layer w0.4: C10.2 49.3,12.94 v2(48.98,12.62)
  Bottom Layer w0.4: U12.2 U12.3
  Bottom Layer w0.6: U12.2 16.89,13.3 16.13,12.53 16.13,7.45 v2(18.95,4.64) NOREF#16.1 26.91,3.14 C157.1 27.17,4.91 28.94,6.69 35.25,6.69 arc(35.36,6.7) 35.47,6.75 35.5,6.75 36.69,7.94 42.64,7.94 46.61,11.9 48.62,11.9 48.98,12.26 v2(48.98,12.62)
  vias: v1(7.49,9.49) v1(20.25,6.44) v1(26.25,6.44) v1(26.25,4.94) v2(15.88,5.8) v2(15.87,4.66) v2(15.88,3.39) v2(15.88,2.25) v2(15.88,0.98) v2(17.4,5.8) v2(17.4,4.66) v2(17.4,3.39) v2(17.4,2.25) v2(17.4,0.98) v2(18.92,5.8) v2(18.92,3.39) v2(18.92,2.25) v2(18.92,0.98) v2(20.57,5.8) v2(20.57,4.66) v2(20.57,3.39) v2(20.58,2.25) v2(20.57,0.98) v2(22.22,5.8) v2(22.25,4.66) v2(22.22,3.39) v2(22.22,2.25) v2(22.22,1.11) v2(23.62,5.8) v2(23.61,4.66) v2(23.62,3.39) v2(23.62,2.25) v2(23.62,1.11) v2(24.89,5.8) v2(24.89,4.66) v2(24.89,3.39) v2(24.89,2.25) v2(24.89,1.11) v2(26.42,1.61) v2(28.32,0.85) v2(28.83,4.81)
AHIGH_1: length 3.2
  Bottom Layer w0.23: v1(19.43,42.13) 20.32,42.13 21.59,40.86 U2.22
AHIGH_2: length 4
  Bottom Layer w0.23: U4.22 38.87,37.94 39.44,38.52 39.44,39.74 39.68,39.97 v1(40.51,39.97)
AHIGH_3: length 3.6
  Bottom Layer w0.23: U3.22 19.08,23.71 18.38,23.01 18.38,22.03 18.03,21.68 v1(17.27,21.68)
AHIGH_4: length 3.9
  Top Layer w0.23: U9.34 37.82,19.52
  Bottom Layer w0.23: v1(37.85,19.52) 37.85,20.13 37.52,20.46 36.32,20.46 35.87,20.91 U5.22
ALOW_1: length 2.5
  Bottom Layer w0.23: U2.1 24.02,39.69 24.63,39.08 v1(25.53,39.08)
ALOW_2: length 2.5
  Bottom Layer w0.23: U4.1 37.44,35.55 36.96,35.06 v1(36.96,34)
ALOW_3: length 2.4
  Bottom Layer w0.23: v1(20.57,27.52) 20.57,26.54 20.09,26.05 U3.1
ALOW_4: length 2.3
  Bottom Layer w0.23: v1(32.13,22.69) 32.68,22.69 33.18,22.2 U5.1
BEMF_COMMON_1: length 21.7
  Top Layer w0.23: R31.2 24.32,46.62 27.56,46.62 v3(28.96,45.23)
  Inner1 w0.23: v3(28.96,45.23) 28.96,36.66 26.36,34.07 v3(23.96,34.07)
  vias: v3(29.21,37.05)
BEMF_COMMON_2: length 21.3
  Top Layer w0.23: R40.2 44.29,35.25 44.29,31.99 R39.2
  Inner1 w0.23: v3(42.95,30.58) 42.8,30.58 42.79,30.57 v3(34.8,30.57) 31.94,33.42 v3(31.94,35.44)
BEMF_COMMON_3: length 23.1
  Top Layer w0.23: R49.2 13.87,24.06 13.05,24.89 13.05,27.23 arc(13.03,27.27) 13.03,27.32 13.03,28.53 14.3,29.8 R48.2 14.03,30.31 v1(13.97,30.31)
  Inner1 w0.23: v3(25.49,26.21) 25.49,28.37 v3(22.73,31.12)
  Inner3 w0.23: v1(13.97,30.31) 14.12,30.17 14.2,30.17 15.16,31.12 v3(22.73,31.12)
BEMF_COMMON_4: length 21.5
  Top Layer w0.23: R58.2 33.07,15.08 29.91,15.08 28.58,16.4
  Inner1 w0.23: v3(33.32,27.71) 31.44,27.71 v3(28.46,24.72) 28.46,16.58 v3(28.58,16.46)
BEMFA_1: length 10.7
  Top Layer w0.23: R29.1 R37.2 R34.1 27.56,33.93 D26.2 ; D26.2 27.56,32.81 C145.1 ; D26.2 26.51,33.36 25.91,32.76 24.6,32.76 24.35,33.01 23.83,33.01 23.46,33.38 U6.11
BEMFA_2: length 10.6
  Top Layer w0.23: U8.11 31.07,35.94 30.64,35.51 30.64,32.82 D29.2 ; R38.1 R46.2 32.51,31.39 ; D29.2 30.81,32.22 C148.1 ; D29.2 31.68,32.22 R43.1
BEMFA_3: length 10.6
  Top Layer w0.23: D32.2 27.05,28.79 27.05,26.5 26.6,26.06 26.6,26.04 26.27,25.71 U7.11 ; D32.2 26.71,29.56 C151.1 ; D32.2 25.73,29.56 R52.1 R47.1
BEMFA_4: length 10.6
  Top Layer w0.23: D35.2 30.1,27.83 R61.1 29.27,27 R64.2 R56.1 ; D35.2 30.65,28.29 31.5,29.14 33.07,29.14 33.82,28.39 U9.11 ; D35.2 30.1,28.71 C154.1
BEMFB_1: length 15.4
  Top Layer w0.23: U6.15 26.83,36.57 27.36,37.1 27.36,42.76 R30.1 R36.2 R33.1 31.82,43.78 D27.2 33.19,43.78 C146.1
BEMFB_2: length 15.2
  Top Layer w0.23: U8.15 34.44,32.85 35.13,32.17 40.69,32.17 R39.1 42.14,28.44 R42.1 41.41,27.7 D30.2 41.41,26.72 C149.1
BEMFB_3: length 15
  Top Layer w0.23: C152.1 15.87,34.16 D33.2 15.87,33.05 R51.1 15.16,32.34 R48.1 16.05,29.16 22.75,29.16 23.09,28.82 U7.15
BEMFB_4: length 15.3
  Top Layer w0.23: C155.1 24.59,18 D36.2 25.58,18 R60.1 26.31,17.27 R57.1 30,18.68 30,24.23 30.98,25.21 U9.15
BEMFC_1: length 13.6
  Top Layer w0.23: D28.2 26.97,43.66 C147.1 ; D28.2 26.92,43.28 26.92,37.28 26.69,37.05 25.48,37.05 U6.16 ; D28.2 25.99,43.66 25.28,44.37 25.23,44.41 R31.1
BEMFC_2: length 12.7
  Top Layer w0.23: D31.2 40.65,32.6 35.31,32.6 34.93,32.98 34.93,33.92 U8.16 ; 42,36.67 42.06,36.61 R41.1 41.15,33.47 ; 41.15,32.94 C150.1
BEMFC_3: length 13.6
  Top Layer w0.23: R49.1 R50.1 15.99,27.12 D34.2 15.99,28.06 15.32,28.72 ; 15.14,28.91 15.32,28.72 ; 15.32,28.72 22.36,28.72 22.59,28.49 U7.16
BEMFC_4: length 13.1
  Top Layer w0.23: D37.2 31.56,18.13 R59.1 R62.2 R58.1 ; D37.2 30.61,18.51 30.61,24.22 31.09,24.71 U9.16 ; D37.2 30.57,18.13 C156.1
BHIGH_1: length 3.4
  Bottom Layer w0.23: U2.23 22.09,40.97 20.5,42.56 v1(19.94,42.56)
BHIGH_2: length 3.8
  Bottom Layer w0.23: U4.23 38.98,37.44 39.88,38.34 39.88,39.23 40.11,39.46 v1(40.51,39.46)
BHIGH_3: length 3.2
  Bottom Layer w0.23: U3.23 18.97,24.21 17.95,23.19 17.95,22.89 17.29,22.23 v1(17.27,22.23)
BHIGH_4: length 3.9
  Top Layer w0.23: 37.32,19.39 U9.33
  Bottom Layer w0.23: U5.23 35.37,20.47 35.81,20.03 37.11,20.03 37.34,19.8 v1(37.34,19.39)
BLOW_1: length 2.4
  Bottom Layer w0.23: U2.2 23.91,39.19 24.53,38.57 v1(25.4,38.57)
BLOW_2: length 2.5
  Bottom Layer w0.23: U4.2 36.94,35.66 36.45,35.16 v1(36.45,34)
BLOW_3: length 2.4
  Bottom Layer w0.23: U3.2 20.59,25.94 21.08,26.44 v1(21.08,27.52)
BLOW_4: length 2.4
  Bottom Layer w0.23: v1(32,23.2) 32.79,23.2 33.29,22.7 U5.2
CHIGH_1: length 2.2
  Bottom Layer w0.23: v1(22.48,42.51) 22.59,42.4 U2.24
CHIGH_2: length 2.4
  Bottom Layer w0.23: U4.24 v1(40.51,36.94)
CHIGH_3: length 2.4
  Bottom Layer w0.23: v1(17.02,24.73) 19.41,24.73 U3.24
CHIGH_4: length 2.2
  Bottom Layer w0.23: U5.24 34.87,19.47 v1(34.8,19.39)
CLOW_1: length 2.4
  Bottom Layer w0.23: U2.3 23.75,38.69 24.38,38.06 v1(25.4,38.06)
CLOW_2: length 2.5
  Bottom Layer w0.23: v1(35.94,34) 35.94,35.27 36.44,35.77 U4.3
CLOW_3: length 2.2
  Bottom Layer w0.23: v1(21.59,27.39) 21.59,26.33 21.15,25.89 21.15,25.43 U3.3
CLOW_4: length 2.4
  Bottom Layer w0.23: U5.3 33.4,23.2 32.89,23.71 v1(32,23.71)
GHA_1: length 20
  Top Layer w0.23: v1(3.98,46.83) 3.86,46.95 R71.1
  Inner2 w0.23: v1(3.98,46.83) 4.32,46.83 5.97,45.17 8.76,45.17 13.34,40.6 17.42,40.6 18.07,41.25 18.66,41.25 v1(19.3,40.6)
  Bottom Layer w0.23: v1(19.3,40.6) 19.83,40.6 U2.19
GHA_2: length 18.5
  Top Layer w0.23: R4.1 v1(52.83,33.24)
  Inner2 w0.23: v1(38.1,39.84) 40.58,37.36 40.69,37.36 41.13,36.91 42.22,36.91 45.89,33.24 v1(52.83,33.24)
  Bottom Layer w0.23: v1(38.1,39.84) 38.1,39.44 U4.19
GHA_3: length 19.4
  Top Layer w0.23: R77.1 v1(4.06,26.12)
  Inner2 w0.23: v1(4.06,26.12) 14.02,26.12 14.18,25.96 14.52,25.96 14.69,26.12 16.76,26.12 19.43,23.46 v1(19.43,21.81)
  Bottom Layer w0.23: U3.19 19.43,22.2 v1(19.43,21.81)
GHA_4: length 20
  Top Layer w0.23: R5.1 v1(52.71,12.15)
  Inner2 w0.23: v1(37.85,21.42) 38.27,21 43.85,21 v1(52.71,12.15)
  Bottom Layer w0.23: U5.19 37.49,21.42 v1(37.85,21.42)
GHB_1: length 16.8
  Top Layer w0.23: R70.1 4.06,40.09
  Inner2 w0.23: 3.94,40.09 v1(4.09,40.09) 17.12,40.09 v1(18.53,38.68)
  Bottom Layer w0.23: v1(18.53,38.68) 19.43,38.68
GHB_2: length 19
  Top Layer w0.23: R3.1 v1(53.21,40.22)
  Inner2 w0.23: v1(36.45,40.86) 38.1,40.86 39.91,39.04 40.69,39.04 41.86,40.22 v1(53.21,40.22)
  Bottom Layer w0.23: U4.16 36.45,40.1 v1(36.45,40.86)
GHB_3: length 19.1
  Top Layer w0.23: R76.1 v1(4.06,19.14)
  Inner2 w0.23: v1(4.06,19.14) 19.31,19.14 v1(21.09,20.92)
  Bottom Layer w0.23: U3.16 v1(21.09,20.92)
GHB_4: length 17.1
  Top Layer w0.23: R6.1 v1(52.83,19.27)
  Inner2 w0.23: v1(38.99,23.2) 42.27,23.2 45.76,19.71 52.39,19.71 v1(52.83,19.27)
  Bottom Layer w0.23: U5.16 v1(38.99,23.2)
GHC_1: length 17.8
  Top Layer w0.23: R69.1 3.93,33.11
  Inner2 w0.23: v1(19.18,36.92) 15.37,33.11 v1(3.94,33.11)
  Bottom Layer w0.23: 19.43,37.17 v1(19.18,36.92)
GHC_2: length 23.7
  Top Layer w0.23: 53.6,46.79 53.6,47.58 v1(53.34,47.84)
  Inner2 w0.23: v1(53.34,47.84) 52.07,47.84 49.28,45.05 45.59,45.05 41.84,41.29 36.27,41.29 36.22,41.24 35.19,41.24 v1(34.5,40.55)
  Bottom Layer w0.23: U4.13 v1(34.5,40.55)
GHC_3: length 24.4
  Top Layer w0.23: R75.1 v1(3.94,12.03)
  Inner2 w0.23: v1(3.94,12.03) 4.07,11.9 13.46,11.9 v1(23.11,21.55)
  Bottom Layer w0.23: U3.13 v1(23.11,21.55)
GHC_4: length 17.1
  Top Layer w0.23: R1.1 v1(52.83,26.25)
  Inner2 w0.23: v1(52.83,26.25) 50.34,23.76 39.57,23.76 v1(38.35,24.98)
  Bottom Layer w0.23: v1(38.35,24.98) 38.07,24.7 U5.13
GLA_1: length 13.8
  Inner1 w0.23: v1(20.57,35.9) 20.57,37.23 16.31,41.49 14.22,41.49 v1(12.19,43.52)
  Bottom Layer w0.23: v1(20.57,35.9) 20.59,35.91 U2.11 ; R72.1 v1(12.19,43.52)
GLA_2: length 22.9
  Inner1 w0.23: v1(33.53,38.94) 32.88,38.94 32.38,38.44 32.38,35.13 35.81,31.7 42.75,31.7 44.58,29.88 v1(44.58,28.03)
  Bottom Layer w0.23: U4.11 v1(33.53,38.94) ; v1(44.58,28.03) R10.1
GLA_3: length 13.5
  Inner1 w0.23: v1(24,22.71) 23.95,22.65 v1(12.57,22.65)
  Bottom Layer w0.23: R78.1 11.38,22.65 v1(12.57,22.65) ; U3.11 v1(24,22.71)
GLA_4: length 24.2
  Inner1 w0.23: v1(44.45,6.95) 43.05,8.34 43.05,17.74 36.87,23.92 v1(36.87,26)
  Bottom Layer w0.23: U5.11 v1(36.87,26) ; v1(44.45,6.95) 45.85,6.95 R9.1
GLB_1: length 11.8
  Inner1 w0.23: v1(21.09,35.78) 21.09,35.4 20.7,35.01 14.35,35.01 v1(12.7,36.66)
  Bottom Layer w0.23: v1(12.7,36.66) 11.29,36.66 ; U2.10 v1(21.09,35.78)
GLB_2: length 17.2
  Inner1 w0.23: v1(44.7,35.01) 33.95,35.01 32.81,36.16 32.81,38.23 33.02,38.44 v1(33.53,38.44)
  Bottom Layer w0.23: U4.10 v1(33.53,38.44) ; v1(44.7,35.01) R7.1
GLB_3: length 18.4
  Inner1 w0.23: v1(24,23.21) 24.25,23.21 24.51,22.95 24.51,21.66 18.68,15.84 v1(12.32,15.84)
  Bottom Layer w0.23: v1(12.32,15.84) 11.28,15.84 R79.1 ; U3.10 v1(24,23.21)
GLB_4: length 19.2
  Inner1 w0.23: v1(44.39,14) 43.69,14.69 43.69,20.43 37.58,26.54 36.48,26.54 36.32,26.38 v1(36.32,26)
  Bottom Layer w0.23: U5.10 36.37,25.95 v1(36.32,26) ; v1(44.39,14) 44.4,14.01 R11.1
GLC_1: length 14
  Inner1 w0.23: v1(21.59,35.65) 21.59,35.14 16.13,29.68 v1(12.57,29.68)
  Bottom Layer w0.23: v1(12.57,29.68) R74.1 ; v1(21.59,35.65) 21.59,36.53 U2.9
GLC_2: length 15.8
  Inner1 w0.23: v1(44.7,42) 44.7,40.35 42.29,37.94 v1(33.53,37.94)
  Bottom Layer w0.23: R13.1 45.84,42 v1(44.7,42) ; U4.9 v1(33.53,37.94)
GLC_3: length 23.7
  Inner1 w0.23: v1(12.32,8.72) 13.84,8.72 24.94,19.83 24.94,23.13 24.37,23.71 v1(24,23.71)
  Bottom Layer w0.23: v1(12.32,8.72) 11.29,8.72 R80.1 ; U3.9 v1(24,23.71)
GLC_4: length 19
  Inner1 w0.23: v1(35.74,26.25) 35.89,26.4 35.89,26.56 36.31,26.97 37.76,26.97 44.07,20.66 44.96,20.66 45.97,19.65 45.97,19.01 46.14,18.85 v1(46.99,18.85)
  Bottom Layer w0.23: R12.1 46.99,19.91 v1(46.99,18.85) ; U5.9 35.87,25.71 35.74,25.84 v1(35.74,26.25)
MOTORA_1: length 31.7
  Top Layer w0.23: 3.36,45.3 v1(3.94,45.3)
  Inner2 w0.23: v1(29.08,34.76) 26.2,37.64 21.65,37.64 18.48,40.81 v1(18.25,40.81)
  Inner3 w0.23: v1(3.94,45.3) 8.51,45.3 13,40.81 v1(18.25,40.81)
  Bottom Layer w0.23: U2.18 19.37,39.69 v1(18.25,40.81)
  vias: v1(2.24,43.58) v1(2.24,42.93) v1(2.24,42.28)
MOTORA_2: length 32
  Top Layer w0.23: C22.2 53.28,31.71 v1(52.83,31.71)
  Inner3 w0.23: 37.64,37.76 42.42,32.98 43.18,32.98 44.45,31.71 v1(52.83,31.71) ; 37.64,37.76 37.64,36.28 35.52,34.17 35.52,33.58 v1(32.51,30.57) ; 37.64,37.76 v1(37.64,40.1)
  Bottom Layer w0.23: U4.18 v1(37.64,40.1) 38.95,41.41
  vias: v1(54.48,29.3) v1(54.61,28.66) v1(54.61,28.03)
MOTORA_3: length 36.3
  Top Layer w0.23: 3.36,24.47 3.39,24.5 v1(4.06,24.5)
  Inner3 w0.23: v1(4.06,24.5) 4.1,24.5 4.13,24.47 13.62,24.47 v1(18.16,19.93) 23.27,19.93 25.27,21.93 25.27,25.83 25.07,26.03 25.07,26.38 25.27,26.58 25.27,30.82 v1(25.02,31.08)
  Bottom Layer w0.23: U3.18 18.52,19.98 C106.2
  vias: v1(2.15,22.78) v1(2.15,22.13) v1(2.15,21.48)
MOTORA_4: length 51.9
  Top Layer w0.23: v1(52.75,10.65) 52.9,10.5 C19.2
  Inner3 w0.23: v1(28.45,27.01) 26.03,24.6 26.03,16.18 25.99,16.14 25.99,15.78 26.03,15.73 26.03,14.95 27.18,13.8 32.89,13.8 38.7,19.61 v1(38.7,21.42) 42.17,21.42 52.75,10.84 v1(52.75,10.65)
  Bottom Layer w0.23: C118.2 39.35,20.77 v1(38.7,21.42) 38.03,22.09 U5.18
  vias: v1(54.64,8.15) v1(54.64,7.5) v1(54.64,6.85)
MOTORB_1: length 32.7
  Top Layer w0.23: 3.36,38.44 v1(3.94,38.44)
  Inner3 w0.23: v1(3.94,38.44) 17.78,38.44 v1(17.99,38.23) 23.92,38.23 30.99,45.3 v1(31.24,45.3)
  Bottom Layer w0.23: C100.2 17.74,38.19 U2.15
  vias: v1(2.16,36.79) v1(2.16,36.1) v1(2.16,35.45)
MOTORB_2: length 33.6
  Top Layer w0.23: v1(43.69,28.41) R42.2 ; C23.2 53.41,38.5 v1(53.47,38.44)
  Inner3 w0.23: v1(53.47,38.44) 52.83,37.81 41.32,37.81 ; v1(35.9,40.68) 35.9,40.9 36.28,41.27 38.11,41.27 41.28,38.11 41.28,37.81 41.32,37.81 ; 41.32,37.81 44.7,34.42 v1(44.7,32.22)
  Inner4 w0.23: v1(44.7,32.22) 44.7,29.43 v1(43.69,28.41)
  Bottom Layer w0.23: 35.9,41.75 v1(35.9,40.68) 35.9,40.14 U4.15
  vias: v1(54.56,36.27) v1(54.56,35.62) v1(54.56,35)
MOTORB_3: length 38.3
  Top Layer w0.23: 3.36,17.49 v1(3.94,17.49)
  Inner2 w0.23: v1(3.94,17.49) 18.36,17.49 v1(21.59,20.72)
  Inner3 w0.23: v1(14.22,32.35) 13.46,31.58 13.46,26.63 15.88,24.22 18.08,24.22 20.97,21.33 21.26,21.33 21.5,21.09 21.5,20.8 v1(21.59,20.72)
  Bottom Layer w0.23: U3.15 v1(21.59,20.72) 21.59,19.73 C105.2
  vias: v1(2.16,15.8) v1(2.16,15.15) v1(2.16,14.5)
MOTORB_4: length 38.1
  Top Layer w0.23: v1(52.86,17.46) 53.25,17.46 C20.2 ; 26.28,16.43 26.42,16.29 v1(26.42,15.96)
  Inner3 w0.23: v1(26.42,15.96) 26.92,15.46 33.66,15.46 35.81,17.61 35.81,20.77 v1(38.75,23.7) 43.85,23.7 50.19,17.36 52.76,17.36 v1(52.86,17.46)
  Bottom Layer w0.23: C117.2 40.21,23.7 v1(38.75,23.7) U5.15
  vias: v1(54.64,15.26) v1(54.64,14.61) v1(54.64,13.96)
MOTORC_1: length 45.9
  Top Layer w0.23: 3.36,31.46 v1(3.94,31.46)
  Inner3 w0.23: v1(3.94,31.46) 11.94,31.46 13.65,33.17 16.44,33.17 v1(18.76,35.49) 20.19,36.92 26.92,36.92 32.26,42.25 32.26,45.81 32.1,45.97 25.94,45.97 v1(25.27,45.3)
  Bottom Layer w0.23: U2.12 19.31,35.76 C99.2
  vias: v1(2.16,29.77) v1(2.16,29.11) v1(2.16,28.47)
MOTORC_2: length 37.8
  Top Layer w0.23: v1(43.31,34.22) 43.08,34.22 R41.2
  Inner3 w0.23: v1(53.29,45.52) 53.2,45.43 45.59,45.43 41.91,41.75 35.05,41.75 33.8,40.49 v1(33.8,39.87) 36.6,39.87 37.34,40.6 38.17,40.6 40.84,37.93 40.84,37.2 41.02,37.02 41.02,36.5 v1(43.31,34.22)
  Bottom Layer w0.23: U4.12 34.22,39.44 v1(33.8,39.87) 32.85,40.81
  vias: v1(54.54,43.17) v1(54.54,41.87) v1(54.61,42.51)
MOTORC_3: length 36.8
  Top Layer w0.23: 3.36,10.38 v1(3.94,10.38)
  Inner3 w0.23: v1(23.87,21.64) 19.13,26.38 v1(14.35,26.38)
  Bottom Layer w0.23: v1(14.35,26.38) 13.01,25.03 13.01,14.6 10.82,12.41 6.48,12.41 4.57,10.5 4.06,10.5 v1(3.94,10.38) ; U3.12 23.24,22.19 C104.2
  vias: v1(2.16,8.72) v1(2.15,8.06) v1(2.15,7.41)
MOTORC_4: length 30.9
  Top Layer w0.23: R59.2 v1(32.26,15.96) ; C21.2 v1(52.83,24.6)
  Inner3 w0.23: v1(52.83,24.6) 43.44,24.6 42.64,25.4 37.94,25.4 v1(37.67,25.66) 32.26,20.25 v1(32.26,15.96)
  Bottom Layer w0.23: 38.69,27.05 38.69,26.68 v1(37.67,25.66) U5.12
  vias: v1(54.61,22.26) v1(54.61,21.61) v1(54.61,20.96)
S-INPUT_1: length 16
  Inner4 w0.23: U1.5 26.69,46.05 27.24,45.49 27.24,34.57 26.03,33.36 v1(25.53,33.36)
S-INPUT_2: length 21.8
  Inner4 w0.23: v1(31.24,33.87) 30.23,32.86 25.53,32.86 25.45,32.93 25.35,32.93 24.69,33.59 U1.6
S-INPUT_3: length 22
  Inner4 w0.23: v1(26.54,27.65) 26.03,28.16 26.03,31.4 23.54,33.89 23.54,47.24 U1.7
S-INPUT_4: length 29.3
  Inner4 w0.23: v1(31.88,28.66) 29.21,28.66 27.76,27.22 26.36,27.22 25.6,27.98 25.6,31.22 23.11,33.71 23.11,45.67 U1.8
$1N8406: length 6.8
  Top Layer w0.23: 4.76,31.46 4.82,31.51 R69.2 ; Q25.4 2.41,27.82 2.77,28.18 2.77,30.01 3,30.23 3.47,30.23 4.69,31.46
$1N8410: length 6.8
  Top Layer w0.23: 4.8,40.09 4.76,40.06 4.76,38.44 ; Q26.4 2.41,34.8 2.77,35.17 2.77,36.99 3,37.22 3.7,37.22 4.8,38.32
$1N8414: length 6.8
  Top Layer w0.23: R71.2 4.76,46.9 4.76,45.3 3.51,44.05 3.08,44.05 2.86,43.82 2.86,42 2.49,41.63 2.24,41.63
$1N9597: length 6.9
  Top Layer w0.23: 4.76,12.03 4.76,10.43 4.82,10.38 3.62,9.18 2.99,9.18 2.77,8.96 2.77,7.13 2.4,6.76 Q31.4
$1N9600: length 7.4
  Top Layer w0.23: 4.76,19.01 4.8,18.98 4.8,16.49 4.57,16.26 3,16.26 2.77,16.04 2.77,14.21 2.37,13.8 2.2,13.8 Q32.4
$1N9603: length 6.9
  Top Layer w0.23: 4.76,26.12 4.76,24.53 4.82,24.47 3.6,23.25 2.99,23.25 2.77,23.03 2.77,21.2 2.4,20.83 Q33.4
$1N10287: length 5.4
  Top Layer w0.23: Q14.4 53.83,44.54 52.32,44.54 51.84,45.02 R14.2
$1N10290: length 5.4
  Top Layer w0.23: Q8.4 53.92,37.55 52.2,37.55 52,37.75 C23.1 52,40.17 R3.2
$1N10293: length 5.3
  Top Layer w0.23: R4.2 51.94,33.23 51.94,30.95 52.32,30.57 53.93,30.57 Q12.4
$1N10977: length 5.5
  Top Layer w0.23: 54.61,22.91 53.94,23.58 52.2,23.58 51.94,23.84 51.94,24.54 C21.1 52,26.2 R1.2
$1N10980: length 5.7
  Top Layer w0.23: Q10.4 54.08,16.47 52.07,16.47 51.91,16.63 51.91,17.52 C20.1 52,19.21 R6.2
$1N10983: length 5.5
  Top Layer w0.23: R5.2 51.94,12.15 51.94,9.74 52.32,9.36 54.08,9.36 Q7.4
$1N11003: length 3.6
  Bottom Layer w0.23: Q3.4 48.88,30.06 47.69,30.06 C14.2 47.36,29.63 R10.2
$1N11004: length 3.7
  Bottom Layer w0.23: Q2.4 48.92,37.05 47.69,37.05 C15.2 47.36,36.61 R7.2
$1N11005: length 3.5
  Bottom Layer w0.23: Q13.4 47.54,43.83 C28.2 47.38,43.56 R13.2
$1N11006: length 3.7
  Bottom Layer w0.23: R74.2 9.79,28.08 C165.2 9.63,27.82 Q28.4
$1N11007: length 3.8
  Bottom Layer w0.23: Q29.4 9.74,34.79 C166.2 9.97,36.61 R73.2
$1N11008: length 3.7
  Bottom Layer w0.23: R72.2 9.84,43.47 C167.2 9.63,41.66 Q30.4
$1N11009: length 3.7
  Bottom Layer w0.23: Q36.4 9.75,20.83 C173.2 9.79,20.97 R78.2
$1N11010: length 3.8
  Bottom Layer w0.23: R79.2 9.71,14.19 C172.2 9.63,13.85 Q35.4
$1N11011: length 3.7
  Bottom Layer w0.23: 7.75,6.73 9.5,6.73 C171.2 9.66,7 R80.2
$1N11012: length 3.4
  Bottom Layer w0.23: R9.2 47.36,8.54 C17.2 47.5,8.79 Q5.4
$1N11013: length 3.7
  Bottom Layer w0.23: R11.2 47.32,15.61 C18.2 47.26,15.92 Q1.4
$1N11014: length 3.8
  Bottom Layer w0.23: Q4.4 48.76,23.2 47.75,23.2 C16.2 47.36,22.68 R12.2
$2N1449: length 3.8
  Bottom Layer w0.23: U2.14 18.81,37.69 18.67,37.55 18.67,36.93 18.18,36.44 C99.1 17.64,35.82 D14.1
$2N1456: length 3.3
  Bottom Layer w0.23: U2.17 19.35,39.12 C100.1 16.98,39.12 D15.1
$2N1466: length 4
  Bottom Layer w0.23: D16.1 18.33,41.91 C101.1 19.88,41.41 20.57,40.71 20.57,40.36 U2.20
$2N2003: length 3.8
  Bottom Layer w0.23: D17.1 24.21,20.04 C104.1 23.3,20.95 22.34,20.95 22.09,21.2 U3.14
$2N2012: length 3.4
  Bottom Layer w0.23: U3.17 20.59,19.72 C105.1 20.66,18.97 D18.1
$2N2033: length 4.6
  Bottom Layer w0.23: U3.20 19.04,22.71 18.81,22.48 18.81,21.53 C106.1 17.36,20.07 D19.1
$2N2566: length 4.6
  Bottom Layer w0.23: U4.14 35.43,40.11 35.43,40.98 35.31,41.11 33.74,41.11 33.06,41.79 D20.1
$2N2575: length 3.2
  Bottom Layer w0.23: D21.1 36.74,42.42 C111.1 36.94,41.54 U4.17
$2N2596: length 4.4
  Bottom Layer w0.23: U4.20 38.6,38.94 38.99,39.33 38.99,40.35 39.45,40.81 39.54,40.81 39.92,41.19 40.94,41.19
$2N3129: length 4.6
  Bottom Layer w0.23: D23.1 39.67,26.84 39.29,26.45 38.99,26.16 38.99,24.73 38.46,24.2 U5.14
$2N3138: length 4.1
  Bottom Layer w0.23: D24.1 40.94,23.04 C117.1 40.05,22.7 U5.17
$2N3159: length 4.3
  Bottom Layer w0.23: D25.1 39.33,19.73 C118.1 38.41,20.18 37.7,20.89 37.17,20.89 36.87,21.19 U5.20
$3N606: length 1.7
  Top Layer w0.23: U6.10 22.96,32.74 22.69,32.47
$3N612: length 1.4
  Top Layer w0.23: R25.2 25.53,35.5 U6.13
$3N615: length 3.3
  Top Layer w0.23: 19.5,31.2 19.72,31.43 C126.1 20.46,33.34 U6.5
$3N1168: length 1.8
  Top Layer w0.23: C130.1 26.85,25.14 26.8,25.14 26.73,25.21 U7.10
$3N1174: length 1.5
  Top Layer w0.23: U7.13 25.54,27.71 R26.2
$3N1177: length 3.4
  Top Layer w0.23: C131.1 28.47,21.84 C132.1 26.32,22.71 U7.5
$3N1730: length 1.7
  Top Layer w0.23: U8.10 30.67,36.44 C136.1
$3N1736: length 1.4
  Top Layer w0.23: 32.06,33.87 33.38,33.87 U8.13
$3N1739: length 3.7
  Top Layer w0.23: U8.5 31.26,38.94 30.35,39.85 C138.1 30.26,39.93 30.04,40.16 28.83,40.16
$3N2292: length 1.8
  Top Layer w0.23: U9.10 34.42,27.8 34.42,28.49 34.84,28.91 C142.1
$3N2298: length 1.5
  Top Layer w0.23: R28.2 31.88,26.27 U9.13
$3N2301: length 3.5
  Top Layer w0.23: C143.1 37.81,30.47 C144.1 37.73,29.3 36.92,28.49 36.92,27.8 U9.5
$4N5396: length 2.2
  Bottom Layer w0.23: 16.37,15.58 16.63,15.84 U12.4
$4N5610: length 2
  Bottom Layer w0.23: U12.7 C158.2
